# Altium schematic sheet COMMS.SchDoc
size A4; Organization: Electronic Research & Design; Address1: 11 Granofier; Address2: Zwartkop; Address3: Centurion; Address4: South Africa; Revision: 0
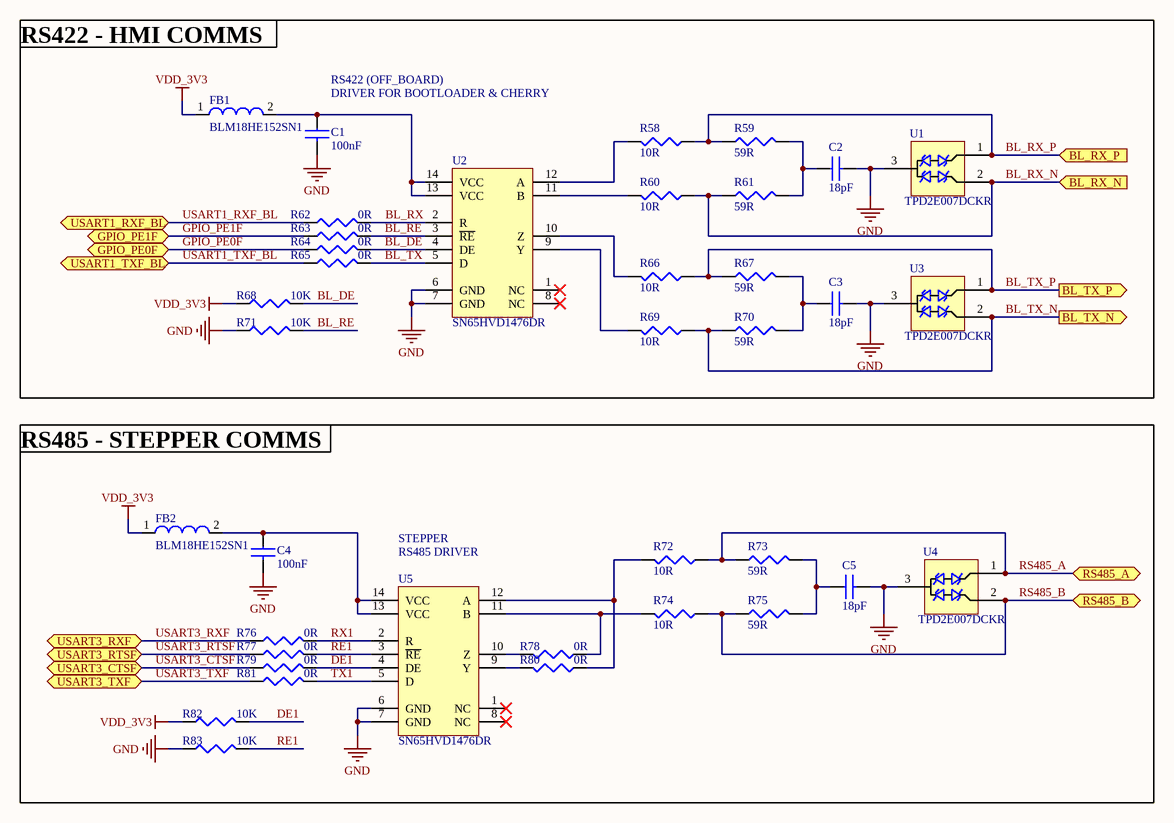
[diagram p0: COMMS.SchDoc]

## Parts
C1  100nF  [CC0402]
C2  18pF  [CC0402]
C3  18pF  [CC0402]
C4  100nF  [CC0402]
C5  18pF  [CC0402]
FB1  BLM18HE152SN1  [LC0603]
FB2  BLM18HE152SN1  [LC0603]
R58  10R  [RC0603]
R59  59R  [RC0402]
R60  10R  [RC0603]
R61  59R  [RC0402]
R62  0R  [RC0402]
R63  0R  [RC0402]
R64  0R  [RC0402]
R65  0R  [RC0402]
R66  10R  [RC0603]
R67  59R  [RC0402]
R68  10K  [RC0402]
R69  10R  [RC0603]
R70  59R  [RC0402]
R71  10K  [RC0402]
R72  10R  [RC0603]
R73  59R  [RC0402]
R74  10R  [RC0603]
R75  59R  [RC0402]
R76  0R  [RC0402]
R77  0R  [RC0402]
R78  0R  [RC0402]
R79  0R  [RC0402]
R80  0R  [RC0402]
R81  0R  [RC0402]
R82  10K  [RC0402]
R83  10K  [RC0402]
U1  TPD2E007DCKR  [SOT23 - DGK]
U2  SN65HVD1476DR  [SOIC-14]
U3  TPD2E007DCKR  [SOT23 - DGK]
U4  TPD2E007DCKR  [SOT23 - DGK]
U5  SN65HVD1476DR  [SOIC-14]

## Ports
BL_RX_N (in), BL_RX_P (in), BL_TX_N (out), BL_TX_P (out), GPIO_PE0F, GPIO_PE1F, RS485_A (bidir), RS485_B (bidir), USART1_RXF_BL, USART1_TXF_BL, USART3_CTSF, USART3_RTSF, USART3_RXF, USART3_TXF

## Nets
GND: C1.2 C2.2 C3.2 C4.2 C5.2 R71.1 R83.1 U1.3(GND) U2.6(GND) U2.7(GND) U3.3(GND) U4.3(GND) U5.6(GND) U5.7(GND)
VDD_3V3: FB1.1 FB2.1 R68.1 R82.1
BL_DE: R64.2 R68.2 U2.4(DE)
BL_RE: R63.2 R71.2 U2.3(~{RE})
BL_RX: R62.2 U2.2(R)
BL_RX_N: R60.1 R61.1 U1.2(IO2) ; port BL_RX_N
BL_RX_P: R58.1 R59.1 U1.1(IO1) ; port BL_RX_P
BL_TX: R65.2 U2.5(D)
BL_TX_N: R69.1 R70.1 U3.2(IO2) ; port BL_TX_N
BL_TX_P: R66.1 R67.1 U3.1(IO1) ; port BL_TX_P
DE1: R79.2 R82.2 U5.4(DE)
GPIO_PE0F: R64.1 ; port GPIO_PE0F
GPIO_PE1F: R63.1 ; port GPIO_PE1F
RE1: R77.2 R83.2 U5.3(~{RE})
RS485_A: R72.1 R73.1 U4.1(IO1) ; port RS485_A
RS485_B: R74.1 R75.1 U4.2(IO2) ; port RS485_B
RX1: R76.2 U5.2(R)
TX1: R81.2 U5.5(D)
USART1_RXF_BL: R62.1 ; port USART1_RXF_BL
USART1_TXF_BL: R65.1 ; port USART1_TXF_BL
USART3_CTSF: R79.1 ; port USART3_CTSF
USART3_RTSF: R77.1 ; port USART3_RTSF
USART3_RXF: R76.1 ; port USART3_RXF
USART3_TXF: R81.1 ; port USART3_TXF
NetC1_1: C1.1 FB1.2 U2.13(VCC) U2.14(VCC)
NetC2_1: C2.1 R59.2 R61.2
NetC3_1: C3.1 R67.2 R70.2
NetC4_1: C4.1 FB2.2 U5.13(VCC) U5.14(VCC)
NetC5_1: C5.1 R73.2 R75.2
NetR58_2: R58.2 U2.12(A)
NetR60_2: R60.2 U2.11(B)
NetR66_2: R66.2 U2.10(Z)
NetR69_2: R69.2 U2.9(Y)
NetR72_2: R72.2 R80.1 U5.12(A)
NetR74_2: R74.2 R78.1 U5.11(B)
NetR78_2: R78.2 U5.10(Z)
NetR80_2: R80.2 U5.9(Y)

Not connected (* = marked no-connect by the designer): U2 1(NC)* 8(NC)*; U5 1(NC)* 8(NC)*

## Notes on the sheet
- RS422 - HMI COMMS
- (near C1) RS422 (OFF_BOARD)
- (near C1) DRIVER FOR BOOTLOADER & CHERRY
- RS485 - STEPPER COMMS
- STEPPER
- (near U5) RS485 DRIVER
- Title:
- Size:
- Date:
- Project:
- A4
- Number:
- Time:
- Revision:
- Sheet
- of
- File:

## Library data of the parts
C1 C4 = CAP CER 0.1UF 10V 10% X5R 0402: CAP CER 0.1UF 50V 10% X7R 0402; Manufacturer: Murata; PartNumber: GCM155R71H104KE02D; Package / Case: 0402 (1005 Metric); Supplier: AAD
C2 C3 C5 = CAP CER 2.2UF 6.3V 10% X5R 0402: CAP CER 18pF 50V 5% C0G 0402; Manufacturer: AVX; PartNumber: GJM1555C1H180FB01D; Package / Case: 0402 (1005 Metric); Supplier: AAD; Supplier Stock Code: N/A
FB1 FB2 = FER_180_200_0: FERRITE, 500mA, 500mOHM, 0603; PartNumber: BLM18HE152SN1
R58 R60 R66 R69 R72 R74 = RES_10K_1/16W_1%_0402: RES 10 OHM 1/10W 5% 0603 SMD; Manufacturer: Yageo; PartNumber: RC0603JR-0710RL; Package / Case: 0402 (1005 Metric); Supplier: AAD; Supplier Stock Code: YAGA-80461
R59 R61 R67 R70 R73 R75 = RES_10K_1/16W_1%_0402: RES, 59 OHM, 1/16W, 1%, 0402; Manufacturer: Yageo; PartNumber: RC0402FR-0759RL; Package / Case: 0402 (1005 Metric); Supplier: AAD
R62-R65 R76-R81 = RES_10K_1/16W_1%_0402: RES, 0 OHM, 1/16W, 1%, 0402; Manufacturer: Yageo; PartNumber: RC0402FR-070RL; Package / Case: 0402 (1005 Metric); Supplier: AAD
R68 R71 R82 R83 = RES_10K_1/16W_1%_0402: RES, 10K OHM, 1/16W, 1%, 0402; Manufacturer: Yageo; Part Number: RC0402FR-0710KL; Package / Case: 0402 (1005 Metric); Supplier: AAD
U1 U3 U4 = TPD2E007: DIODE, TVS, 2-CHANNEL ESD PROTECTION ARRAY, SOT23; Manufacturer: Texas Instruments; PartNumber: TPD2E007DCKR; Supplier: Digikey; Supplier Part Number: 296-24599-2-ND
U2 U5 = SN65HVD1476: Transceiver, RS-485/422, Full-Duplex, SOIC-14; PartNumber: SN65HVD1476DR